# EAGLE schematic test (EAGLE 7.2.0)
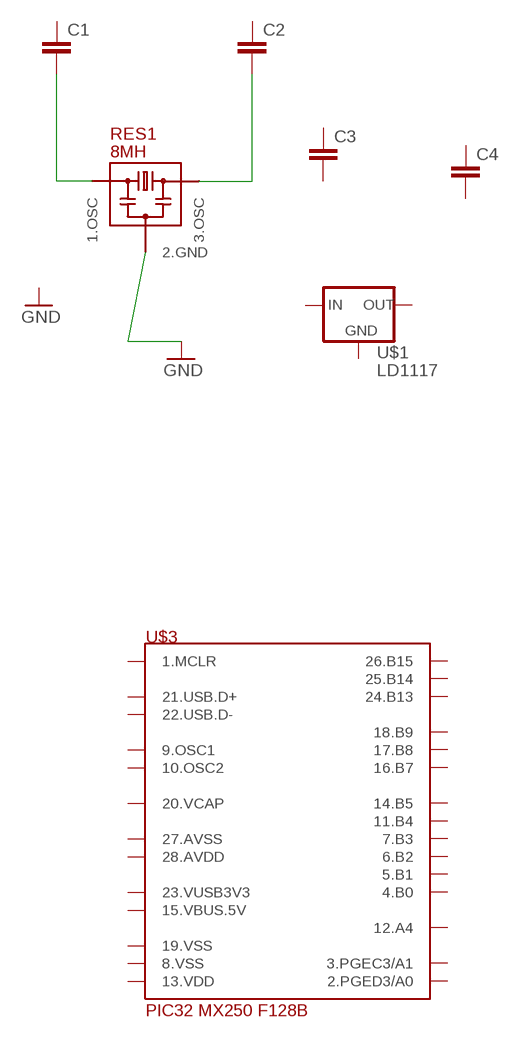
[diagram p0: schematic, sheet 1]

## Parts
C1  CAPPTH1  [CAP-PTH-5MM]
C2  CAPPTH1  [CAP-PTH-5MM]
C3  CAPPTH1  [CAP-PTH-5MM]
C4  CAPPTH  [CAP-PTH-SMALL]
RES1  8MH  RESONATOR  [RESONATOR_PTH]
U$1  LD1117  [TO220]
U$3  PIC32MX250F128B  [DIL_28_3_JOHN]

## Nets
GND: RES1.P$2(2.GND)
N$1: C1.2 RES1.P$3(1.OSC)
N$2: C2.2 RES1.P$1(3.OSC)
Unconnected: C1.1 C2.1 C3.1 C3.2 C4.1 C4.2 U$1.1(GND) U$1.2(OUT) U$1.3(IN) U$3.P$1(1.MCLR) U$3.P$2(2.PGED3/A0) U$3.P$3(3.PGEC3/A1) U$3.P$4(4.B0) U$3.P$5(5.B1) U$3.P$6(6.B2) U$3.P$7(7.B3) U$3.P$9(9.OSC1) U$3.P$10(10.OSC2) U$3.P$11(11.B4) U$3.P$12(12.A4) U$3.P$14(14.B5) U$3.P$16(16.B7) U$3.P$17(17.B8) U$3.P$18(18.B9) U$3.P$21(21.USB.D+) U$3.P$22(22.USB.D-) U$3.P$24(24.B13) U$3.P$25(25.B14) U$3.P$26(26.B15)

## Power pins joined to a net without a drawn wire
8.VSS: U$3.P$8(8.VSS)
13.VDD: U$3.P$13(13.VDD)
15.VBUS.5V: U$3.P$15(15.VBUS.5V)
19.VSS: U$3.P$19(19.VSS)
20.VCAP: U$3.P$20(20.VCAP)
23.VUSB3V3: U$3.P$23(23.VUSB3V3)
27.AVSS: U$3.P$27(27.AVSS)
28.AVDD: U$3.P$28(28.AVDD)

## Library data of the parts
C1-C4 = john433:CAP: Capacitor Standard 0603 ceramic capacitor, and 0.1" leaded capacitor.
RES1 = john433:RESONATOR
U$1 = ME433:LD1117
U$3 = john433:PIC32MX250F128B